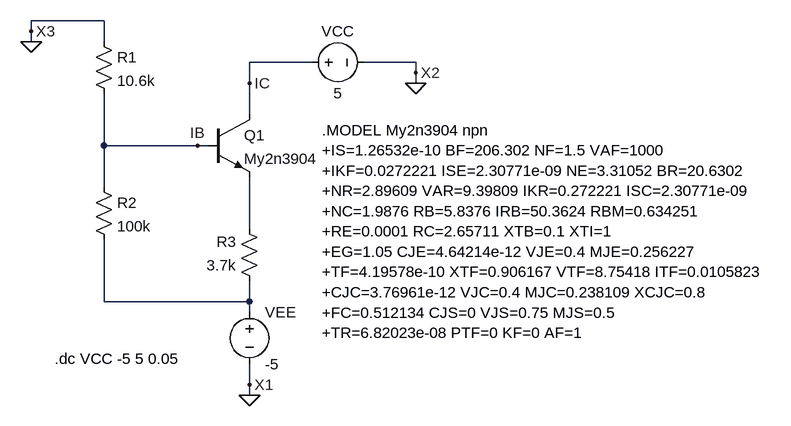
[diagram p0: schematic project1_p3.asc]
project1_p3.asc, the LTspice schematic file:
Version 4
SHEET 1 1048 680
WIRE -32 -64 -144 -64
WIRE -144 -48 -144 -64
WIRE -144 -32 -144 -48
WIRE -32 -32 -32 -64
WIRE 288 0 192 0
WIRE 448 0 368 0
WIRE 448 16 448 0
WIRE 192 32 192 0
WIRE 448 32 448 16
WIRE 192 80 192 32
WIRE -32 128 -32 48
WIRE 112 128 -32 128
WIRE 128 128 112 128
WIRE -32 192 -32 128
WIRE 192 256 192 176
WIRE -32 368 -32 272
WIRE 192 368 192 336
WIRE 192 368 -32 368
WIRE 192 384 192 368
WIRE 192 496 192 464
WIRE 192 512 192 496
FLAG 192 512 0
FLAG 448 32 0
FLAG 192 496 X1
FLAG 448 16 X2
FLAG -144 -32 0
FLAG -144 -48 X3
FLAG 192 32 IC
FLAG 112 128 IB
SYMBOL npn 128 80 R0
SYMATTR InstName Q1
SYMATTR Value My2n3904
SYMBOL res 208 352 R180
WINDOW 0 36 76 Left 2
WINDOW 3 36 40 Left 2
SYMATTR InstName R3
SYMATTR Value 3.7k
SYMBOL voltage 192 368 R0
SYMATTR InstName VEE
SYMATTR Value -5
SYMBOL voltage 272 0 R270
WINDOW 0 32 56 VTop 2
WINDOW 3 -32 56 VBottom 2
SYMATTR InstName VCC
SYMATTR Value 5
SYMBOL res -48 -48 R0
SYMATTR InstName R1
SYMATTR Value 10.6k
SYMBOL res -48 176 R0
SYMATTR InstName R2
SYMATTR Value 100k
TEXT 304 104 Left 2 !.MODEL My2n3904 npn\n+IS=1.26532e-10 BF=206.302 NF=1.5 VAF=1000\n+IKF=0.0272221 ISE=2.30771e-09 NE=3.31052 BR=20.6302\n+NR=2.89609 VAR=9.39809 IKR=0.272221 ISC=2.30771e-09\n+NC=1.9876 RB=5.8376 IRB=50.3624 RBM=0.634251\n+RE=0.0001 RC=2.65711 XTB=0.1 XTI=1\n+EG=1.05 CJE=4.64214e-12 VJE=0.4 MJE=0.256227\n+TF=4.19578e-10 XTF=0.906167 VTF=8.75418 ITF=0.0105823\n+CJC=3.76961e-12 VJC=0.4 MJC=0.238109 XCJC=0.8\n+FC=0.512134 CJS=0 VJS=0.75 MJS=0.5\n+TR=6.82023e-08 PTF=0 KF=0 AF=1
TEXT -108 456 Left 2 !.dc VCC -5 5 0.05

The netlist it stands for:
* project1_p3.asc
Q1 IC IB N001 0 My2n3904
R3 N002 N001 3.7k
VEE N002 0 -5
VCC IC 0 5
R1 0 IB 10.6k
R2 IB N002 100k
.model NPN NPN
.model PNP PNP
.lib standard.bjt
.MODEL My2n3904 npn
+IS=1.26532e-10 BF=206.302 NF=1.5 VAF=1000
+IKF=0.0272221 ISE=2.30771e-09 NE=3.31052 BR=20.6302
+NR=2.89609 VAR=9.39809 IKR=0.272221 ISC=2.30771e-09
+NC=1.9876 RB=5.8376 IRB=50.3624 RBM=0.634251
+RE=0.0001 RC=2.65711 XTB=0.1 XTI=1
+EG=1.05 CJE=4.64214e-12 VJE=0.4 MJE=0.256227
+TF=4.19578e-10 XTF=0.906167 VTF=8.75418 ITF=0.0105823
+CJC=3.76961e-12 VJC=0.4 MJC=0.238109 XCJC=0.8
+FC=0.512134 CJS=0 VJS=0.75 MJS=0.5
+TR=6.82023e-08 PTF=0 KF=0 AF=1
.dc VCC -5 5 0.05
.backanno
.end